# Altium schematic sheet 2021-03-03_19-36-571.schdoc
size 452 x 137 mm; SheetNumber: 1; SheetTotal: 1
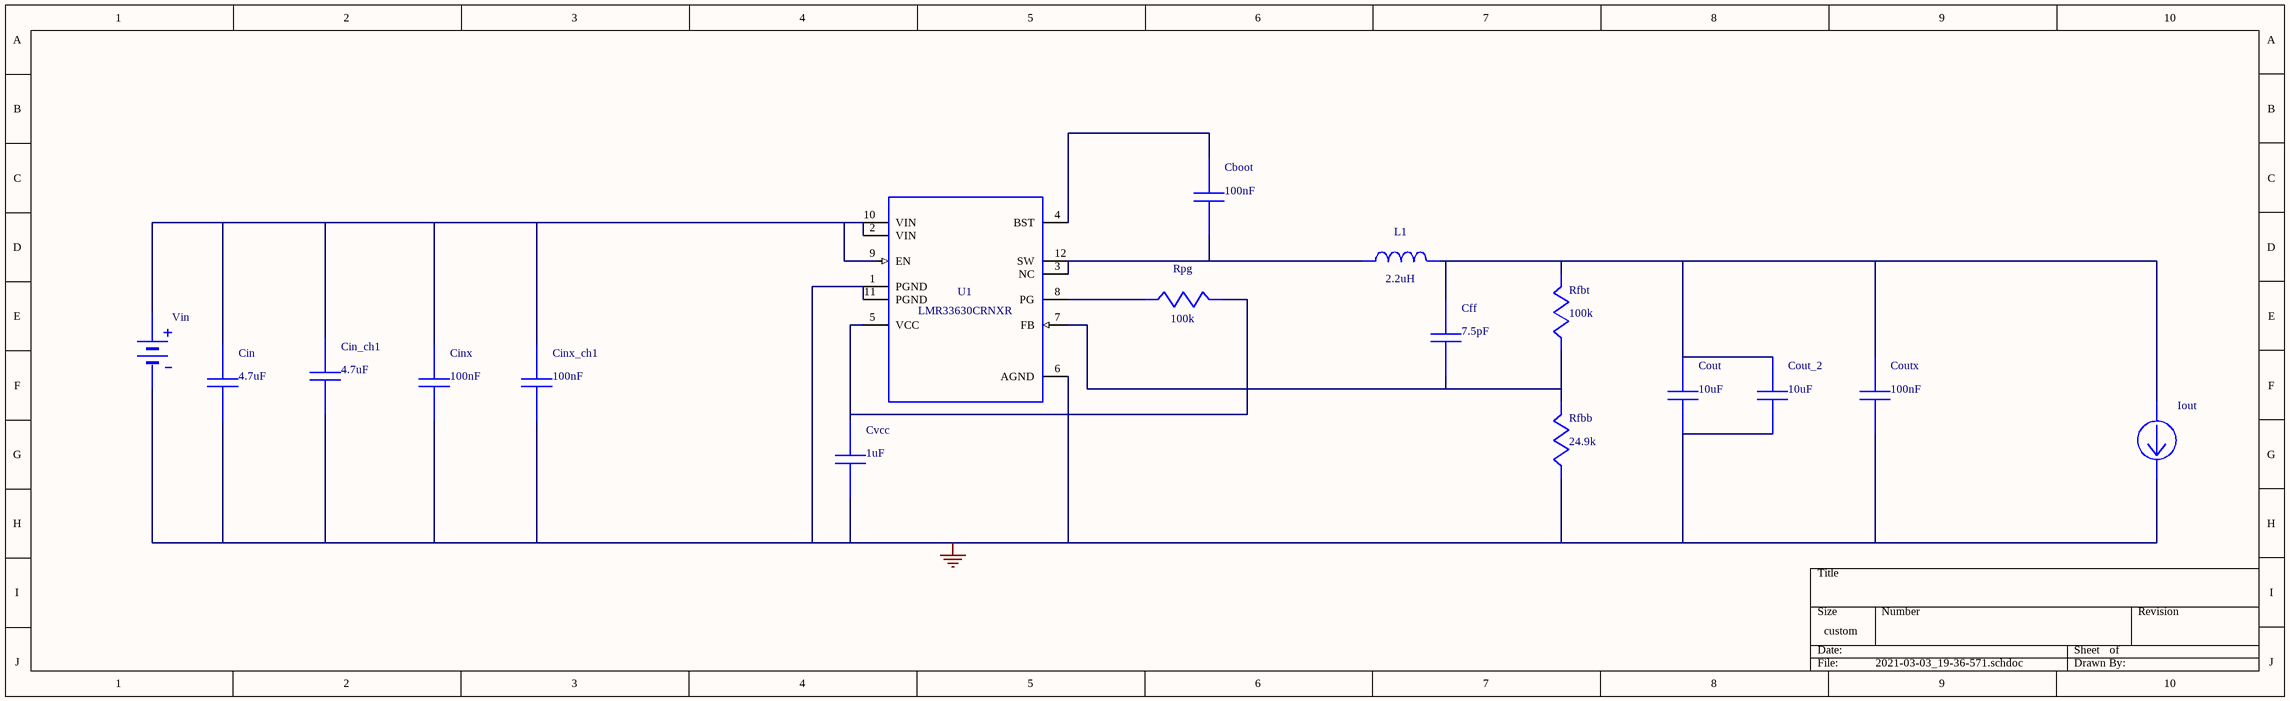
[diagram p0: 2021-03-03_19-36-571.schdoc]

## Parts
Cboot  value 100nF  (hidden comment: GRM155R71C104KA88D)
Cff  value 7.5pF  (hidden comment: GRM1555C1H7R5CA01D)
Cin  value 4.7uF  (hidden comment: GRM31CR71H475KA12L)
Cin_ch1  value 4.7uF  (hidden comment: GRM31CR71H475KA12L)
Cinx  value 100nF  (hidden comment: GRM188R72A104KA35D)
Cinx_ch1  value 100nF  (hidden comment: GRM188R72A104KA35D)
Cout  value 10uF  (hidden comment: C0805C106K8PACTU)
Cout_2  value 10uF  (hidden comment: C0805C106K8PACTU)
Coutx  value 100nF  (hidden comment: GRM188R71E104KA01D)
Cvcc  value 1uF  (hidden comment: C0603C105K8PACTU)
Iout  WB_CURRENT_LOAD  (value not drawn)
L1  value 2.2uH  (hidden comment: VLP8040T-2R2N)
Rfbb  value 24.9k  (hidden comment: CRCW040224K9FKED)
Rfbt  value 100k  (hidden comment: CRCW0402100KFKED)
Rpg  value 100k  (hidden comment: CRCW0402100KFKED)
U1  LMR33630CRNXR
Vin  WB_BATTERY  (value not drawn)

## Nets
0: Cin.2 Cin_ch1.2 Cinx.2 Cinx_ch1.2 Cout.2 Cout_2.2 Coutx.2 Cvcc.2 Iout.2(-) Rfbb.2 U1.1(PGND) U1.6(AGND) U1.11(PGND) Vin.2(-)
NetCboot_1: Cboot.1 U1.4(BST)
NetCboot_2: Cboot.2 L1.1 U1.3(NC) U1.12(SW)
NetCff_1: Cff.1 Cout.1 Cout_2.1 Coutx.1 Iout.1(+) L1.2 Rfbt.1
NetCff_2: Cff.2 Rfbb.1 Rfbt.2 U1.7(FB)
NetCin_1: Cin.1 Cin_ch1.1 Cinx.1 Cinx_ch1.1 U1.2(VIN) U1.9(EN) U1.10(VIN) Vin.1(+)
NetCvcc_1: Cvcc.1 Rpg.1 U1.5(VCC)
NetRpg_2: Rpg.2 U1.8(PG)

## Library data of the parts
Cboot = GRM155R71C104KA88D: GRM155R71C104KA8; Manufacturer Name: MuRata; PackageReference: GRM155R71C104KA88D; Manufacturer Part Number: GRM155R71C104KA88D
Cff = GRM1555C1H7R5CA01D: GRM1555C1H7R5CA0; Manufacturer Name: MuRata; PackageReference: GRM1555C1H7R5CA01D; Manufacturer Part Number: GRM1555C1H7R5CA01D
Cin Cin_ch1 = GRM31CR71H475KA12L: GRM31CR71H475KA1; Manufacturer Name: MuRata; PackageReference: GRM31CR71H475KA12L; Manufacturer Part Number: GRM31CR71H475KA12L
Cinx Cinx_ch1 = GRM188R72A104KA35D: GRM188R72A104KA3; Manufacturer Name: MuRata; PackageReference: GRM188R72A104KA35D; Manufacturer Part Number: GRM188R72A104KA35D
Cout Cout_2 = C0805C106K8PACTU: Manufacturer Name: Kemet; PackageReference: C0805C106K8PACTU; Manufacturer Part Number: C0805C106K8PACTU
Coutx = GRM188R71E104KA01D: GRM188R71E104KA0; Manufacturer Name: MuRata; PackageReference: GRM188R71E104KA01D; Manufacturer Part Number: GRM188R71E104KA01D
Cvcc = C0603C105K8PACTU: Manufacturer Name: Kemet; PackageReference: C0603C105K8PACTU; Manufacturer Part Number: C0603C105K8PACTU
L1 = VLP8040T-2R2N: Unknown; Manufacturer Name: TDK; PackageReference: VLP8040T-2R2N; Manufacturer Part Number: VLP8040T-2R2N
Rfbb = CRCW040224K9FKED: Manufacturer Name: Vishay-Dale; PackageReference: CRCW040224K9FKED; Manufacturer Part Number: CRCW040224K9FKED
Rfbt Rpg = CRCW0402100KFKED: Manufacturer Name: Vishay-Dale; PackageReference: CRCW0402100KFKED; Manufacturer Part Number: CRCW0402100KFKED
U1 = LMR33630CRNXR: Manufacturer Name: Texas Instruments; PackageReference: LMR33630CRNXR; Manufacturer Part Number: LMR33630CRNXR; Value: N/A
Iout = WB_CURRENT_LOAD: PackageReference: WB_CURRENT_LOAD; Manufacturer Part Number: WB_CURRENT_LOAD; Manufacturer Name: WB_CURRENT_LOAD; Value: N/A
Vin = WB_BATTERY: PackageReference: WB_BATTERY; Manufacturer Part Number: WB_BATTERY; Manufacturer Name: WB_BATTERY; Value: N/A